# EAGLE design xnor (EAGLE 7.2.0)
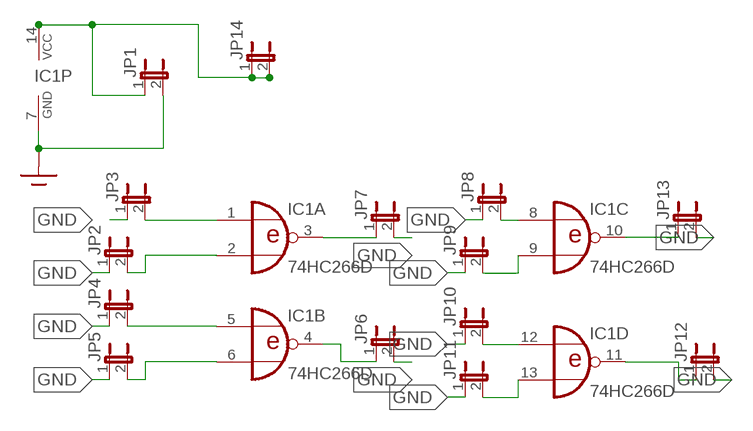
[diagram p0: schematic, sheet 1]

## Parts
IC1  74HC266D  [SO14]
JP1  JP1E  [JP1]
JP2  JP1E  [JP1]
JP3  JP1E  [JP1]
JP4  JP1E  [JP1]
JP5  JP1E  [JP1]
JP6  JP1E  [JP1]
JP7  JP1E  [JP1]
JP8  JP1E  [JP1]
JP9  JP1E  [JP1]
JP10  JP1E  [JP1]
JP11  JP1E  [JP1]
JP12  JP1E  [JP1]
JP13  JP1E  [JP1]
JP14  JP1E  [JP1]

## Nets
GND: IC1.7(P:GND) JP1.2 JP2.1 JP3.1 JP4.1 JP5.1 JP6.2 JP7.2 JP8.1 JP9.1 JP10.1 JP11.1 JP12.2 JP13.2
N$2: IC1.10(C:O) JP13.1
N$3: IC1.1(A:I0) JP3.2
N$4: IC1.2(A:I1) JP2.2
N$5: IC1.5(B:I0) JP4.2
N$6: IC1.6(B:I1) JP5.2
N$7: IC1.4(B:O) JP6.1
N$8: IC1.3(A:O) JP7.1
N$9: IC1.8(C:I0) JP8.2
N$10: IC1.9(C:I1) JP9.2
N$11: IC1.12(D:I0) JP10.2
N$12: IC1.13(D:I1) JP11.2
N$13: IC1.11(D:O) JP12.1
VCC: IC1.14(P:VCC) JP1.1 JP14.1 JP14.2

## Library data of the parts
IC1 = 74xx-eu:74*266: Quadruple EXCLUSIVE-NOR (XNOR), open-collector
JP1-JP14 = jumper:JP1E: JUMPER

## Board
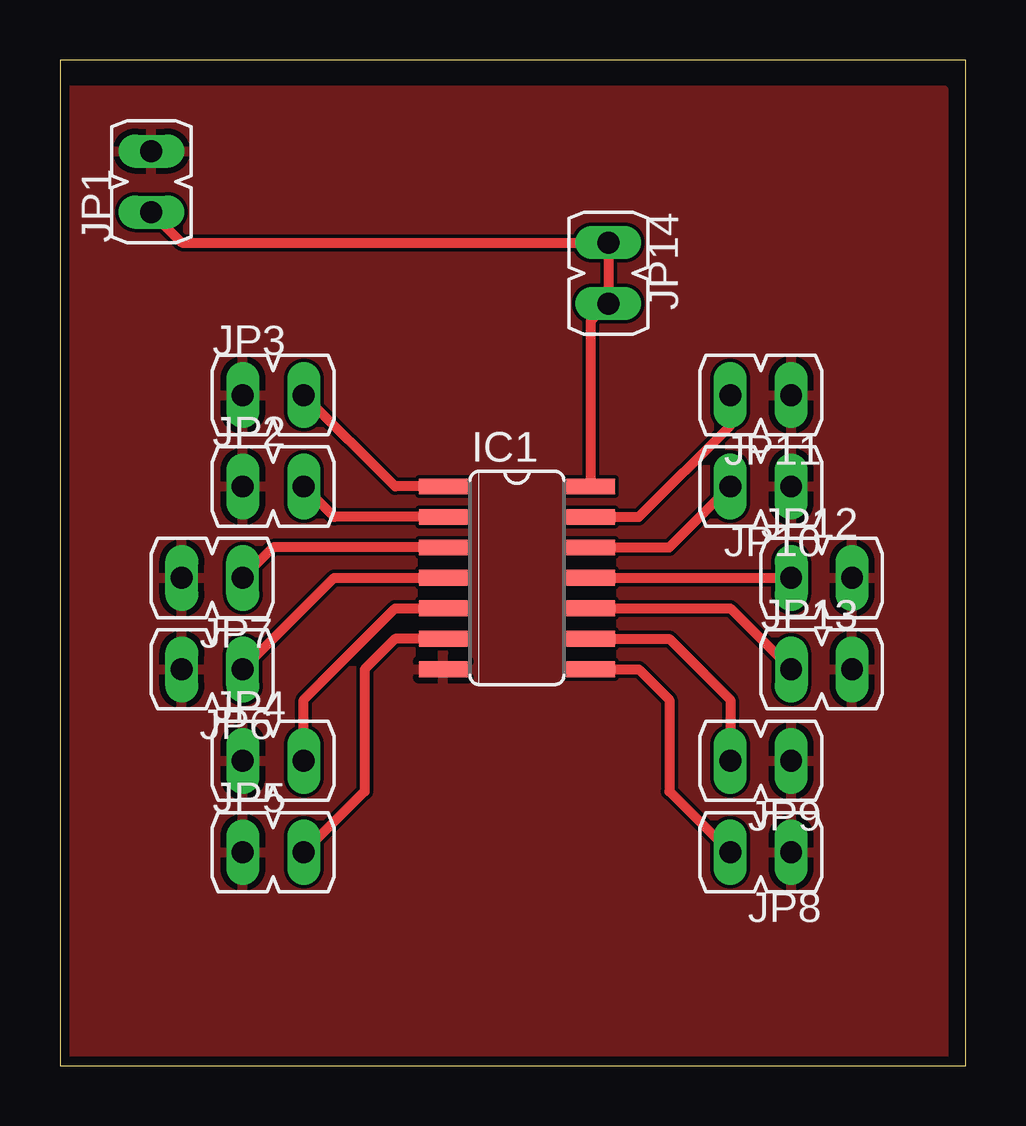
[diagram p1: board, top side]

Size 37.77 x 41.9 mm. Coordinates in mm from the lower left corner, seen from the top.
Outline: 0,0 37.77,0 37.77,41.9 0,41.9 0,0
Copper layers (1*16): Top 0.0356mm / dielectric 1.5011mm / Bottom 0.0356mm
Design rules "OSHpark": minimum track width 6mil, minimum drill 13mil, track to track 6mil, track to pad 6mil, pad to pad 6mil, via to via 6mil, smd to smd 6mil, copper to edge 15mil, drill to drill 6mil, minimum pad ring 7mil, minimum via ring 7mil, stop-mask expansion 3mil, vias tented up to drill 0mil, thermal gap 10mil

### Footprints (pad centres in the part's own frame; a part is rotated, then mirrored left to right if it is on the bottom)
SO14 = smd 0.66 x 2.032: 1 -3.81,-3.073; 2 -2.54,-3.073; 3 -1.27,-3.073; 4 0,-3.073; 5 1.27,-3.073; 6 2.54,-3.073; 7 3.81,-3.073; 8 3.81,3.073; 9 2.54,3.073; 10 1.27,3.073; 11 0,3.073; 12 -1.27,3.073; 13 -2.54,3.073; 14 -3.81,3.073
JP1 = drill 0.914 long: 1 0,-1.27; 2 0,1.27

### Placement (x,y rotation side)
IC1  19.05,20.32 270 top
JP1  3.81,36.83 0 top
JP2  8.89,24.13 270 top
JP3  8.89,27.94 270 top
JP4  8.89,12.7 270 top
JP5  8.89,8.89 270 top
JP6  6.35,16.51 90 top
JP7  6.35,20.32 90 top
JP8  29.21,8.89 90 top
JP9  29.21,12.7 90 top
JP10  29.21,24.13 90 top
JP11  29.21,27.94 90 top
JP12  31.75,20.32 270 top
JP13  31.75,16.51 270 top
JP14  22.86,33.02 180 top

### Tracks (layer width: path | path; a pad name or v marks a point on that pad's centre or on a via)
GND
  pour Top: -5.08,40.64 36.83,40.64 36.83,-1.27 -5.08,-1.27
N$2
  Top 0.406: IC1.10 27.94,19.05 JP13.1
N$3
  Top 0.406: IC1.1 13.97,24.13 JP3.2
N$4
  Top 0.406: IC1.2 11.43,22.86 JP2.2
N$5
  Top 0.406: JP4.2 10.16,15.24 13.97,19.05 IC1.5
N$6
  Top 0.406: IC1.6 13.97,17.78 12.7,16.51 12.7,11.43 JP5.2
N$7
  Top 0.406: JP6.1 11.43,20.32 IC1.4
N$8
  Top 0.406: IC1.3 8.89,21.59 JP7.1
N$9
  Top 0.406: IC1.8 24.13,16.51 25.4,15.24 25.4,11.43 JP8.2
N$10
  Top 0.406: IC1.9 25.4,17.78 27.94,15.24 JP9.2
N$11
  Top 0.406: IC1.12 25.4,21.59 JP10.2
N$12
  Top 0.406: IC1.13 24.13,22.86 27.94,26.67 JP11.2
N$13
  Top 0.406: IC1.11 JP12.1
VCC
  Top 0.406: JP1.1 5.08,34.29 JP14.1 JP14.2 22.12,31.01 IC1.14